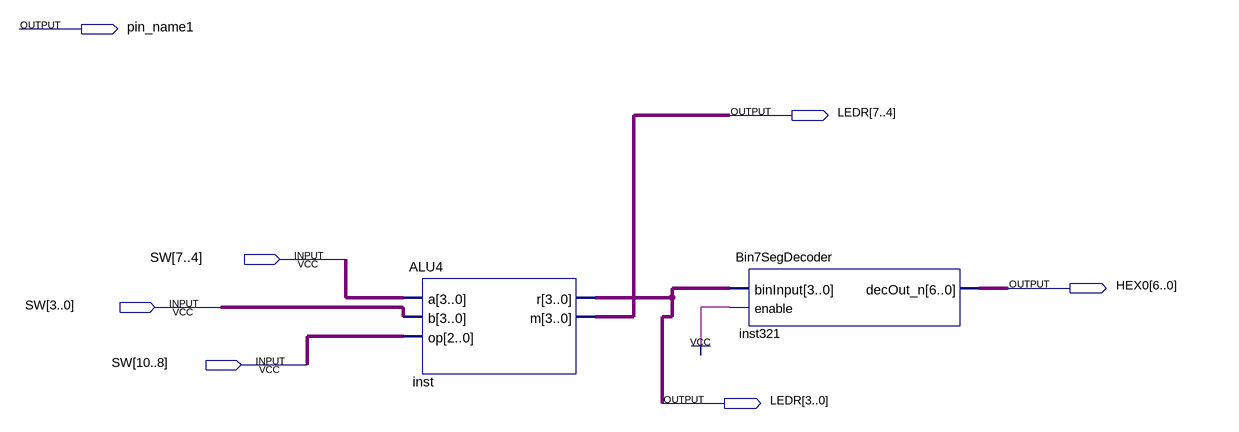
[diagram p0: schematic sheet]
// Quartus schematic ALUDemo.bdf as structural Verilog: 2 symbols, 7 pins
module ALUDemo (
  input  [10:0] SW,
  output pin_name1,
  output [7:0] LEDR,
  output [6:0] HEX0
);

  ALU4 inst (.a(SW[7:4]), .b(SW[3:0]), .op(SW[10:8]), .r(LEDR[3:0]), .m(LEDR[7:4]));
  Bin7SegDecoder inst321 (.binInput(LEDR[3:0]), .enable(1'b1), .decOut_n(HEX0));
endmodule
